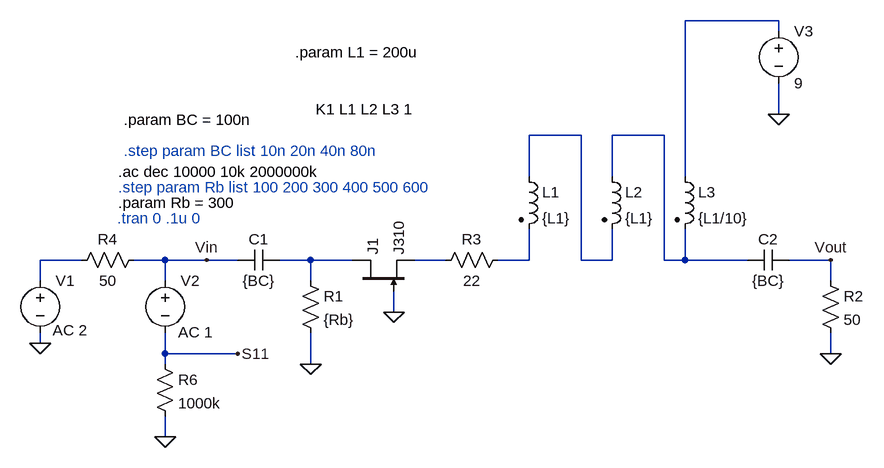
[diagram p0: schematic ece522p3.2.asc]
ece522p3.2.asc, the LTspice schematic file:
Version 4
SHEET 1 1640 696
WIRE 848 -192 704 -192
WIRE 848 -176 848 -192
WIRE 848 -48 848 -96
WIRE 544 -16 464 -16
WIRE 672 -16 592 -16
WIRE 464 48 464 -16
WIRE 592 48 592 -16
WIRE 704 48 704 -192
WIRE -224 176 -288 176
WIRE -96 176 -144 176
WIRE -32 176 -96 176
WIRE 16 176 -32 176
WIRE 128 176 80 176
WIRE 192 176 128 176
WIRE 336 176 288 176
WIRE 464 176 464 128
WIRE 464 176 416 176
WIRE 544 176 544 -16
WIRE 592 176 592 128
WIRE 592 176 544 176
WIRE 672 176 672 -16
WIRE 704 176 704 128
WIRE 704 176 672 176
WIRE 800 176 704 176
WIRE 928 176 864 176
WIRE -288 208 -288 176
WIRE -96 208 -96 176
WIRE 128 208 128 176
WIRE 928 208 928 176
WIRE 256 256 256 224
WIRE -288 304 -288 288
WIRE -96 320 -96 288
WIRE 16 320 -96 320
WIRE 928 320 928 288
WIRE -96 336 -96 320
WIRE 128 336 128 288
WIRE -96 448 -96 416
FLAG -288 304 0
FLAG -96 448 0
FLAG 128 336 0
FLAG 256 256 0
FLAG 16 320 S11
FLAG -32 176 Vin
FLAG 848 -48 0
FLAG 928 320 0
FLAG 928 176 Vout
SYMBOL cap 80 160 R90
WINDOW 0 0 32 VBottom 2
WINDOW 3 32 32 VTop 2
SYMATTR InstName C1
SYMATTR Value {BC}
SYMBOL res 112 192 R0
SYMATTR InstName R1
SYMATTR Value {Rb}
SYMBOL res 432 160 R90
WINDOW 0 0 56 VBottom 2
WINDOW 3 32 56 VTop 2
SYMATTR InstName R3
SYMATTR Value 22
SYMBOL njf 192 224 R270
SYMATTR InstName J1
SYMATTR Value J310
SYMBOL voltage -288 192 R0
WINDOW 3 24 152 Left 2
WINDOW 123 19 92 Left 2
WINDOW 39 0 0 Left 0
SYMATTR InstName V1
SYMATTR Value ""
SYMATTR Value2 AC 2
SYMBOL voltage -96 192 R0
WINDOW 123 20 95 Left 2
WINDOW 39 0 0 Left 0
SYMATTR InstName V2
SYMATTR Value ""
SYMATTR Value2 AC 1
SYMBOL res -128 160 R90
WINDOW 0 0 56 VBottom 2
WINDOW 3 32 56 VTop 2
SYMATTR InstName R4
SYMATTR Value 50
SYMBOL res -112 320 R0
SYMATTR InstName R6
SYMATTR Value 1000k
SYMBOL voltage 848 -192 R0
WINDOW 123 0 0 Left 0
WINDOW 39 0 0 Left 0
SYMATTR InstName V3
SYMATTR Value 9
SYMBOL res 912 192 R0
SYMATTR InstName R2
SYMATTR Value 50
SYMBOL ind2 448 32 R0
SYMATTR InstName L1
SYMATTR Value {L1}
SYMATTR Type ind
SYMBOL ind2 576 32 R0
SYMATTR InstName L2
SYMATTR Value {L1}
SYMATTR Type ind
SYMBOL ind2 688 32 R0
SYMATTR InstName L3
SYMATTR Value {L1/10}
SYMATTR Type ind
SYMBOL cap 864 160 R90
WINDOW 0 0 32 VBottom 2
WINDOW 3 32 32 VTop 2
SYMATTR InstName C2
SYMATTR Value {BC}
TEXT -168 40 Left 2 !.ac dec 10000 10k 2000000k
TEXT -168 64 Left 2 ;.step param Rb list 100 200 300 400 500 600
TEXT -168 88 Left 2 !.param Rb = 300
TEXT -170 112 Left 2 ;.tran 0 .1u 0
TEXT 104 -144 Left 2 !.param L1 = 200u
TEXT 136 -56 Left 2 !K1 L1 L2 L3 1
TEXT -160 8 Left 2 ;.step param BC list 10n 20n 40n 80n
TEXT -160 -40 Left 2 !.param BC = 100n

The netlist it stands for:
* ece522p3.2.asc
C1 N005 Vin {BC}
R1 N005 0 {Rb}
R3 N007 N006 22
J1 N005 0 N006 J310
V1 N004 0 AC 2
V2 Vin S11 AC 1
R4 Vin N004 50
R6 S11 0 1000k
V3 N001 0 9
R2 Vout 0 50
L1 N002 N007 {L1}
L2 N003 N002 {L1}
L3 N001 N003 {L1/10}
C2 Vout N003 {BC}
.model NJF NJF
.model PJF PJF
.lib standard.jft
.ac dec 10000 10k 2000000k
* .step param Rb list 100 200 300 400 500 600
.param Rb = 300
* .tran 0 .1u 0
.param L1 = 200u
K1 L1 L2 L3 1
* .step param BC list 10n 20n 40n 80n
.param BC = 100n
.backanno
.end